# Altium schematic sheet pca10201_top_level.SchDoc: =BoardTitle + ' - Top Level'
size A3; Organization: Nordic Semiconductor; DocumentNumber: 1; SheetNumber: 1; SheetTotal: 10; CompanyName: Nordic Semiconductor; DocumentSize: A3
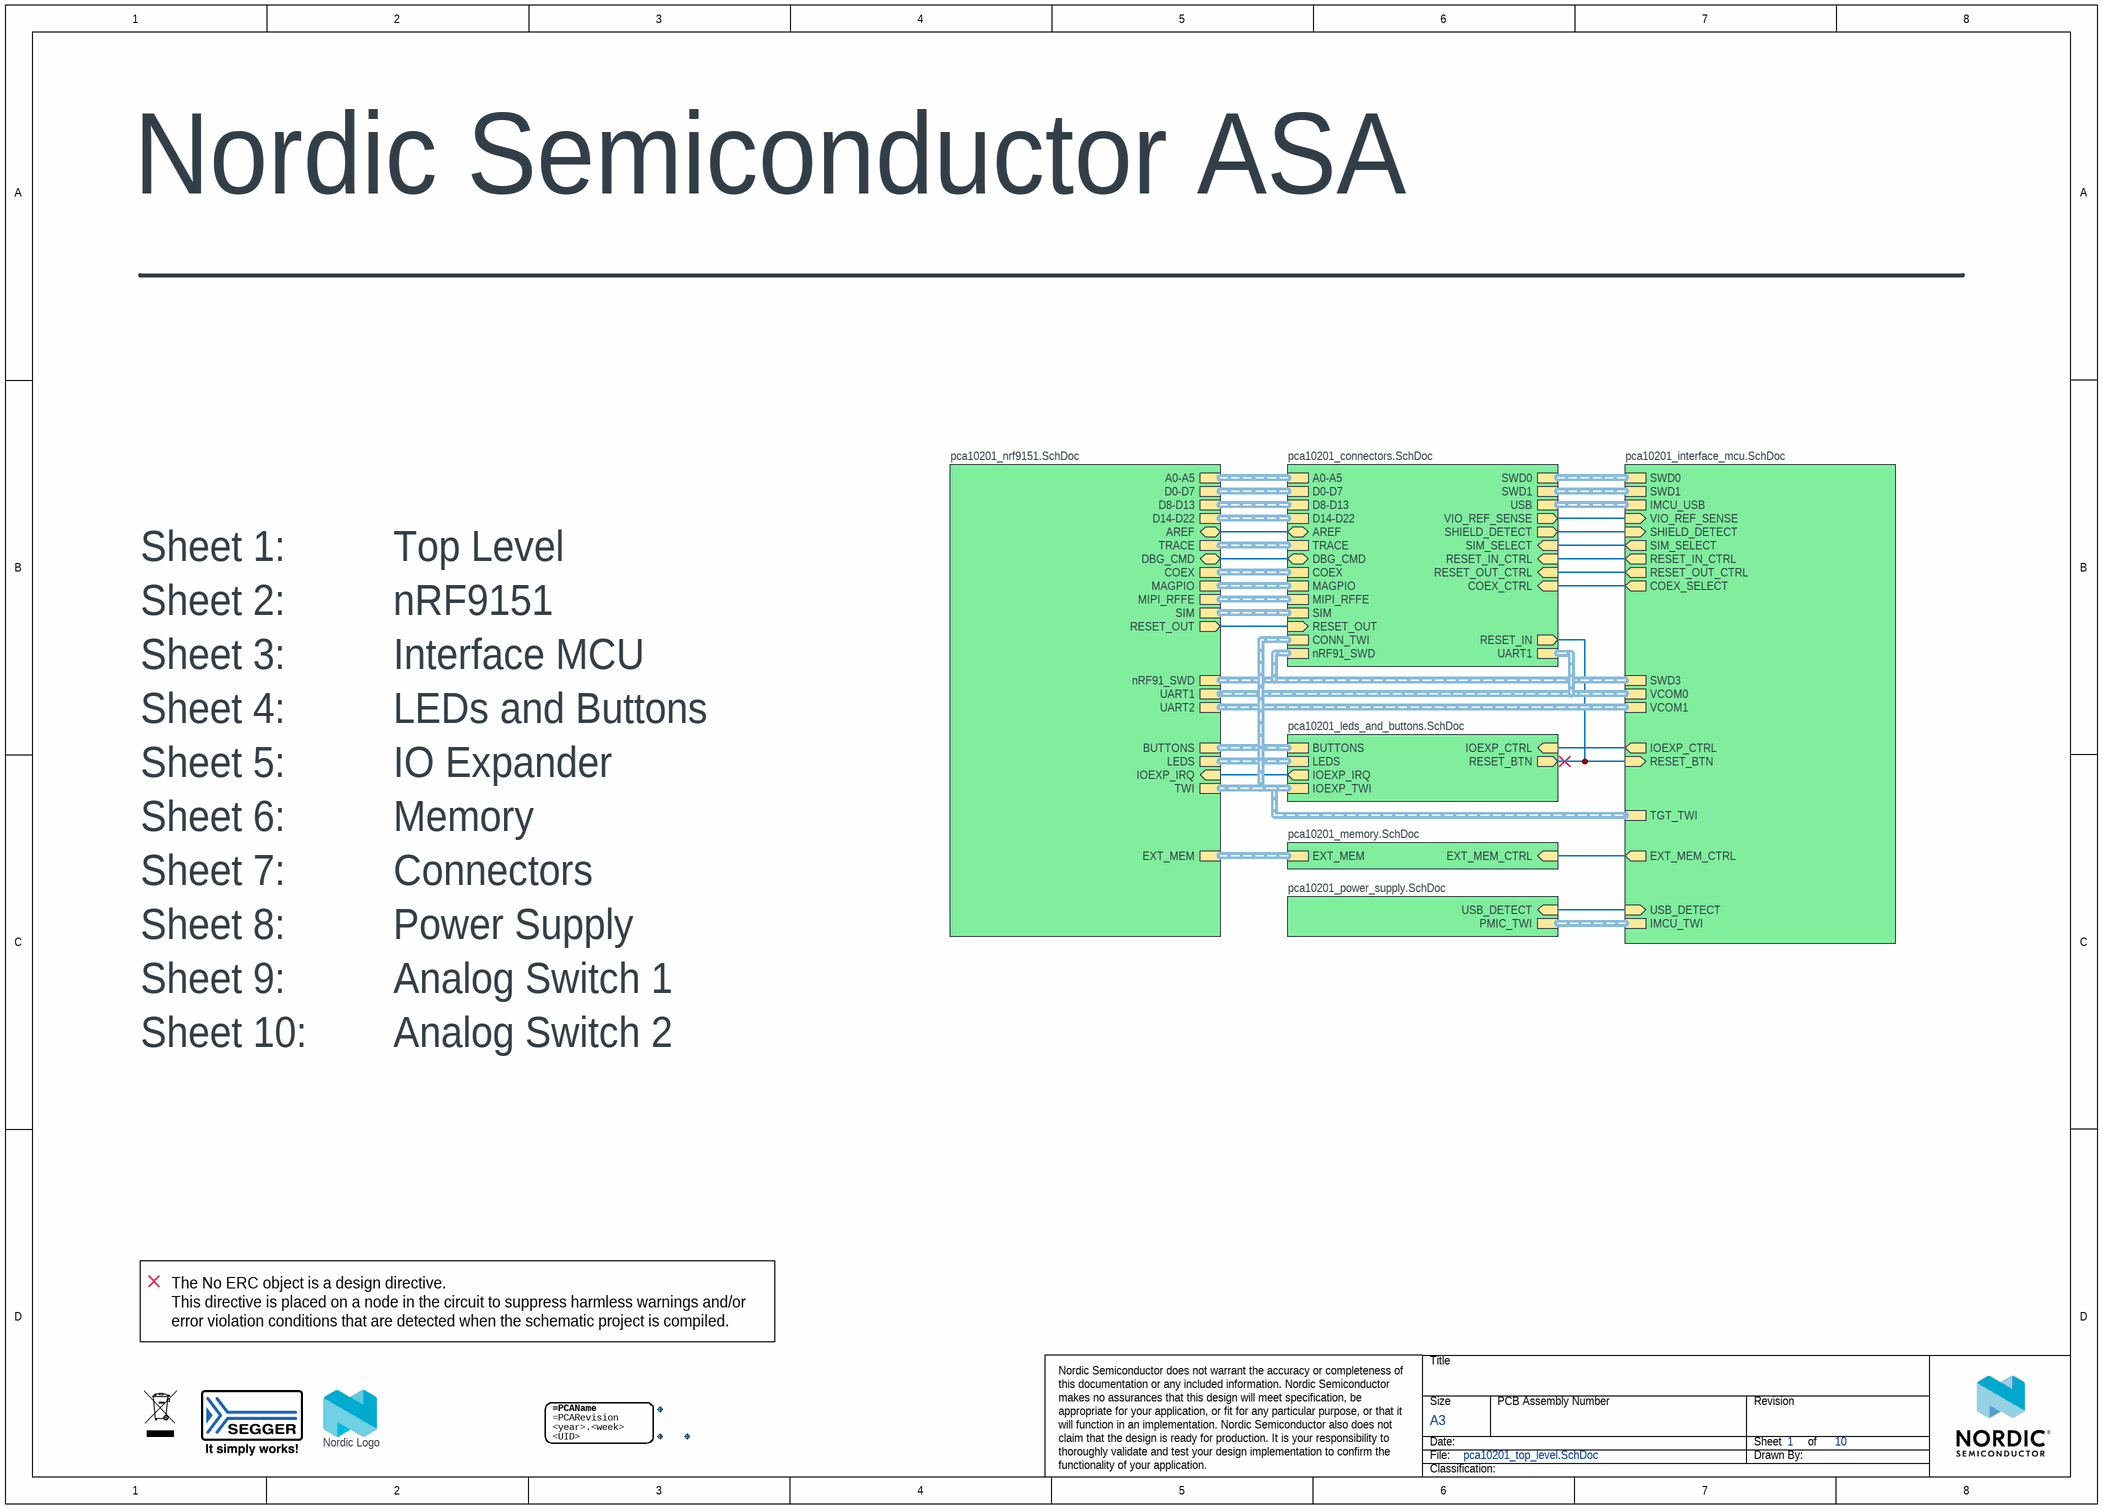
[diagram p0: pca10201_top_level.SchDoc]

## Parts
Fid1  Fiducial mark  [Fiducial]  (value not drawn)
Fid2  Fiducial mark  [Fiducial]  (value not drawn)
Fid3  Fiducial mark  [Fiducial]  (value not drawn)
LABEL1  15x40mm  [LabelSilk_15x40]  (value not drawn)
LOGO1  WEE Symbol  [WEEE_3x4.5mm]  (value not drawn)  (no BOM)
LOGO2  Segger Logo S  [SEGGER_LOGO_S]  (value not drawn)  (no BOM)
LOGO3  Nordic Logo  [NORDIC_LOGO_LYING]  (no BOM)

## Sub-sheets
? = pca10201_nrf9151.SchDoc: nRF91_SWD (harness SWD), DBG_CMD (bidir), UART1 (harness UART), COEX (harness COEX), UART2 (harness UART), SIM (harness SIM), TWI (harness TWI), A0-A5 (harness 6CH), AREF (bidir), TRACE (harness TRACE), BUTTONS (harness 4CH), LEDS (harness 4CH), IOEXP_IRQ (in), EXT_MEM (harness SPI), MIPI_RFFE (harness MIPI_RFFE), MAGPIO (harness MAGPIO), RESET_OUT (out), D8-D13 (harness 6CH), D14-D22 (harness 9CH), D0-D7 (harness 8CH)
? = pca10201_interface_mcu.SchDoc: VCOM1 (harness UART), VCOM0 (harness UART), USB_DETECT (in), RESET_BTN (in), SWD3 (harness SWD), SWD1 (harness SWD), IMCU_USB (harness USB), SWD0 (harness SWD), COEX_SELECT (out), IOEXP_CTRL (out), SIM_SELECT (out), TGT_TWI (harness TWI), VIO_REF_SENSE (in), IMCU_TWI (harness TWI), RESET_IN_CTRL (out), EXT_MEM_CTRL (out), SHIELD_DETECT (in), RESET_OUT_CTRL (out)
? = pca10201_leds_and_buttons.SchDoc: BUTTONS (harness 4CH), LEDS (harness 4CH), IOEXP_CTRL (in), IOEXP_IRQ (out), RESET_BTN (out), IOEXP_TWI (harness TWI)
? = pca10201_memory.SchDoc: EXT_MEM_CTRL (in), EXT_MEM (harness SPI)
? = pca10201_connectors.SchDoc: COEX (harness COEX), nRF91_SWD (harness SWD), DBG_CMD (bidir), MIPI_RFFE (harness MIPI_RFFE), A0-A5 (harness 6CH), TRACE (harness TRACE), USB (harness USB), SIM (harness SIM), AREF (bidir), MAGPIO (harness MAGPIO), SWD0 (harness SWD), SWD1 (harness SWD), SHIELD_DETECT (out), UART1 (harness UART), SIM_SELECT (in), VIO_REF_SENSE (out), CONN_TWI (harness TWI), RESET_IN_CTRL (in), RESET_OUT (in), RESET_OUT_CTRL (in), RESET_IN (out), D8-D13 (harness 6CH), D14-D22 (harness 9CH), D0-D7 (harness 8CH), COEX_CTRL (in)
? = pca10201_power_supply.SchDoc: USB_DETECT (in), PMIC_TWI (harness TWI)

## Nets
(unnamed): sheet /DBG_CMD, sheet /DBG_CMD
(unnamed): sheet /AREF, sheet /AREF
(unnamed): sheet /IOEXP_IRQ, sheet /IOEXP_IRQ
(unnamed): sheet /RESET_OUT, sheet /RESET_OUT
(unnamed): sheet /USB_DETECT, sheet /USB_DETECT
(unnamed): sheet /RESET_BTN, sheet /RESET_BTN, sheet /RESET_IN
(unnamed): sheet /COEX_SELECT, sheet /COEX_CTRL
(unnamed): sheet /IOEXP_CTRL, sheet /IOEXP_CTRL
(unnamed): sheet /SIM_SELECT, sheet /SIM_SELECT
(unnamed): sheet /VIO_REF_SENSE, sheet /VIO_REF_SENSE
(unnamed): sheet /RESET_IN_CTRL, sheet /RESET_IN_CTRL
(unnamed): sheet /EXT_MEM_CTRL, sheet /EXT_MEM_CTRL
(unnamed): sheet /SHIELD_DETECT, sheet /SHIELD_DETECT
(unnamed): sheet /RESET_OUT_CTRL, sheet /RESET_OUT_CTRL

## Buses and harness runs
harness sheet /CONN_TWI = sheet /IOEXP_TWI = sheet /TGT_TWI = sheet /TWI
harness sheet /IMCU_TWI = sheet /PMIC_TWI
harness sheet /IMCU_USB = sheet /USB
harness sheet /nRF91_SWD = sheet /SWD3
harness sheet /UART1 = sheet /VCOM0
harness sheet /UART2 = sheet /VCOM1

## Notes on the sheet
- Sheet 1:          Top Level
- Sheet 2:          nRF9151
- Sheet 3:          Interface MCU
- Sheet 4:          LEDs and Buttons
- Sheet 5:          IO Expander
- Sheet 6:          Memory
- Sheet 7:          Connectors
- Sheet 8:          Power Supply
- Sheet 9:          Analog Switch 1
- Sheet 10:        Analog Switch 2
- The No ERC object is a design directive.
  This directive is placed on a node in the circuit to suppress harmless warnings and/or error violation conditions that are detected when the schematic project is compiled.
- Nordic Semiconductor ASA
- Title
- Size
- Date:
- File:
- A3
- PCB Assembly Number
- Sheet
- Drawn By:
- Revision
- of
- Nordic Semiconductor does not warrant the accuracy or completeness of this documentation or any included information. Nordic Semiconductor makes no assurances that this design will meet specification, be appropriate for your application, or fit for any particular purpose, or that it will function in an implementation. Nordic Semiconductor also does not claim that the design is ready for production. It is your responsibility to thoroughly validate and test your design implementation to confirm the functionality of your application.
  © Nordic Semiconductor — All rights reserved.
- Classification:
- (in symbol Label_15x40) <year>.<week>; <UID>

## Library data of the parts
Fid1-Fid3 = Fid-Mark: Manufacturer: N.A.; Part number NEMS: 100500073; Value: N.A.; Assembly: Not mounted; Pad Count: 1; Component Status: Active; System: Connector; Part Number: Fid-Mark; Manufacturer Part Number: N.A.; LatestRevisionDate: 2009-12-12; Published: 2009-12-12; Note: N.A.; Artikkelnr Noca: N.A.; Footprint Doc: Fiducial; Part number IPS: N.A.; ComponentLink1URL: N.A.; ComponentLink1Description: Datasheet; ComponentLink2URL: N.A.; ComponentLink2Description: Supplier link; HelpURL: N.A.; Supplier 1: N.A.; Supplier Part Number 1: N.A.; Supplier 2: N.A.; Supplier Part Number 2: N.A.; PartId: 100500073; Component Class: Connectors; Author: rsk; Part number Norautron: N.A.
LABEL1 = Label_15x40: PCA version label, stick-on, 15x40mm; Manufacturer: Ellco Etikett; Manufacturer Part Number: 51945; Part number NEMS: 101200030; Component Status: Active; Pad Count: 0; Note: N.A.; Assembly: See section for "Marking/ Stick-on label specification; Part Number: Label_15x40; Component Class: Mechanicals; Author: hany; ComponentLink1URL: N.A.; ComponentLink1Description: Datasheet; ComponentLink2URL: N.A.; ComponentLink2Description: Supplier link; HelpURL: N.A.; LatestRevisionDate: 2023-01-05; Published: 2023-01-05; Footprint Doc: Label; Value: 15x40mm; Supplier 1: N.A.; Supplier Part Number 1: N.A.; Supplier 2: N.A.; Supplier Part Number 2: N.A.; Artikkelnr Noca: N.A.; Part number IPS: N.A.; Part number Norautron: N.A.; PartId: 101200030
LOGO1 = WEEE Symbol 3x4.5mm: WEEE Directive symbol; Manufacturer: N.A.; Part number NEMS: 101100006; Component Status: Active; Pad Count: 0; Part Number: WEEE Symbol 3x4.5mm; PartId: 101100006; Component Class: Markings; Author: rsk; Manufacturer Part Number: N.A.; ComponentLink1URL: N.A.; ComponentLink1Description: Datasheet; ComponentLink2URL: N.A.; ComponentLink2Description: Supplier link; HelpURL: N.A.; LatestRevisionDate: 2023-03-07; Published: 2016-09-07; Footprint Doc: WEEE_3x4.5mm; Value: WEE Symbol; Note: N.A.; Supplier 1: N.A.; Supplier Part Number 1: N.A.; Supplier 2: N.A.; Supplier Part Number 2: N.A.; Artikkelnr Noca: N.A.; Part number IPS: N.A.; Part number Norautron: N.A.
LOGO2 = Segger Logo S: Segger logo, small size; Manufacturer: N.A.; Part number NEMS: 101100004; Component Status: Active; Pad Count: 0; Part Number: Segger Logo S; PartId: 101100004; Component Class: Markings; Author: rsk; Manufacturer Part Number: N.A.; ComponentLink1URL: N.A.; ComponentLink1Description: Datasheet; ComponentLink2URL: N.A.; ComponentLink2Description: Supplier link; HelpURL: N.A.; LatestRevisionDate: 2016-09-07; Published: 2016-09-07; Footprint Doc: Segger Logo S; Value: Segger Logo S; Note: N.A.; Supplier 1: N.A.; Supplier Part Number 1: N.A.; Supplier 2: N.A.; Supplier Part Number 2: N.A.; Artikkelnr Noca: N.A.; Part number IPS: N.A.; Part number Norautron: N.A.
LOGO3 = Nordic Logo lying: Manufacturer: N.A.; Part number NEMS: 101100001; Component Status: Active; Pad Count: 0; Part Number: Nordic Logo lying; PartId: 101100001; Component Class: Markings; Author: rsk; Manufacturer Part Number: N.A.; ComponentLink1URL: N.A.; ComponentLink1Description: Datasheet; ComponentLink2URL: N.A.; ComponentLink2Description: Supplier link; HelpURL: N.A.; LatestRevisionDate: 2017-03-20; Published: 2017-09-01; Footprint Doc: Nordic Logo; Value: Nordic Logo; Note: N.A.; Supplier 1: N.A.; Supplier Part Number 1: N.A.; Supplier 2: N.A.; Supplier Part Number 2: N.A.; Artikkelnr Noca: N.A.; Part number IPS: N.A.; Part number Norautron: N.A.